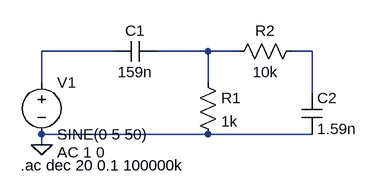
[diagram p0: schematic elecfest_bpf.asc]
elecfest_bpf.asc, the LTspice schematic file:
Version 4.1
SHEET 1 880 680
WIRE 80 64 -32 64
WIRE 224 64 144 64
WIRE 272 64 224 64
WIRE 384 64 352 64
WIRE -32 112 -32 64
WIRE 224 112 224 64
WIRE 384 128 384 64
WIRE 224 192 -32 192
WIRE 384 192 224 192
WIRE -32 208 -32 192
FLAG -32 208 0
SYMBOL voltage -32 96 R0
WINDOW 123 24 124 Left 2
WINDOW 39 0 0 Left 0
SYMATTR Value2 AC 1 0
SYMATTR InstName V1
SYMATTR Value SINE(0 5 50)
SYMBOL cap 144 48 R90
WINDOW 0 0 32 VBottom 2
WINDOW 3 32 32 VTop 2
SYMATTR InstName C1
SYMATTR Value 159n
SYMBOL res 368 48 R90
WINDOW 0 0 56 VBottom 2
WINDOW 3 32 56 VTop 2
SYMATTR InstName R2
SYMATTR Value 10k
SYMBOL res 208 96 R0
SYMATTR InstName R1
SYMATTR Value 1k
SYMBOL cap 368 128 R0
SYMATTR InstName C2
SYMATTR Value 1.59n
TEXT -64 240 Left 2 !.ac dec 20 0.1 100000k

The netlist it stands for:
* elecfest_bpf.asc
V1 N001 0 SINE(0 5 50) AC 1 0
C1 N002 N001 159n
R2 N003 N002 10k
R1 N002 0 1k
C2 N003 0 1.59n
.ac dec 20 0.1 100000k
.backanno
.end